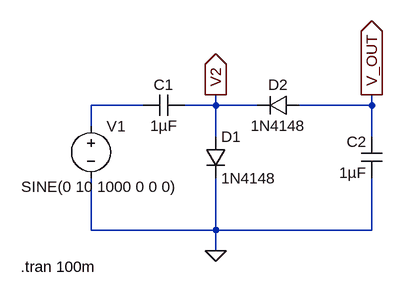
[diagram p0: schematic Lab5.asc]
Lab5.asc, the LTspice schematic file:
Version 4
SHEET 1 880 680
WIRE 192 96 112 96
WIRE 304 96 304 80
WIRE 304 96 256 96
WIRE 368 96 304 96
WIRE 544 96 544 80
WIRE 544 96 432 96
WIRE 112 128 112 96
WIRE 304 144 304 96
WIRE 544 144 544 96
WIRE 112 288 112 208
WIRE 304 288 304 208
WIRE 304 288 112 288
WIRE 544 288 544 208
WIRE 544 288 304 288
WIRE 304 320 304 288
FLAG 304 320 0
FLAG 544 80 V_OUT
IOPIN 544 80 Out
FLAG 304 80 V2
IOPIN 304 80 Out
SYMBOL voltage 112 112 R0
WINDOW 3 -107 109 Left 2
WINDOW 123 0 0 Left 0
WINDOW 39 0 0 Left 0
SYMATTR InstName V1
SYMATTR Value SINE(0 10 1000 0 0 0)
SYMBOL diode 288 144 R0
SYMATTR InstName D1
SYMATTR Value 1N4148
SYMBOL diode 432 80 R90
WINDOW 0 0 32 VBottom 2
WINDOW 3 32 32 VTop 2
SYMATTR InstName D2
SYMATTR Value 1N4148
SYMBOL cap 256 80 R90
WINDOW 0 0 32 VBottom 2
WINDOW 3 32 32 VTop 2
SYMATTR InstName C1
SYMATTR Value 1µF
SYMBOL cap 560 208 R180
WINDOW 0 24 56 Left 2
WINDOW 3 24 8 Left 2
SYMATTR InstName C2
SYMATTR Value 1µF
TEXT 4 344 Left 2 !.tran 100m

The netlist it stands for:
* Lab5.asc
V1 N001 0 SINE(0 10 1000 0 0 0)
D1 V2 0 1N4148
D2 V_OUT V2 1N4148
C1 V2 N001 1µF
C2 0 V_OUT 1µF
.model D D
.lib standard.dio
.tran 100m
.backanno
.end